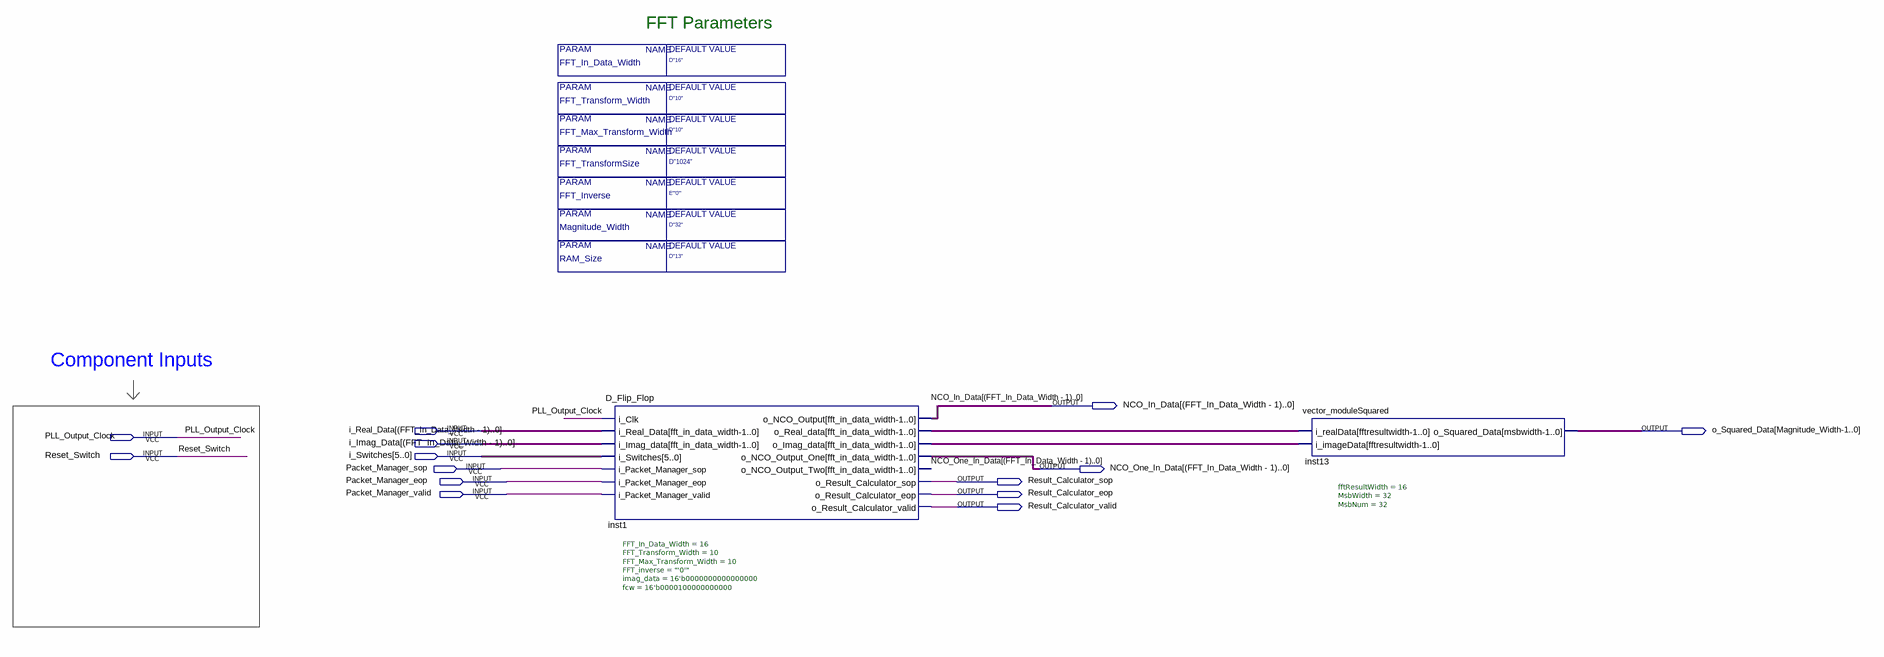
[diagram p0: schematic sheet]
// Quartus schematic FFT_Result_Calculator.bdf as structural Verilog: 2 symbols, 14 pins
module FFT_Result_Calculator #(parameter FFT_Inverse = "E\"'0'\"", parameter FFT_In_Data_Width = "D\"16\"", parameter RAM_Size = "D\"13\"", parameter Magnitude_Width = "D\"32\"", parameter FFT_TransformSize = "D\"1024\"", parameter FFT_Max_Transform_Width = "D\"10\"", parameter FFT_Transform_Width = "D\"10\"") (
  input  \i_Real_Data[(FFT_In_Data_Width_-_1)..0] ,
  input  PLL_Output_Clock,
  input  \i_Imag_Data[(FFT_In_Data_Width_-_1)..0] ,
  input  Reset_Switch,
  input  [5:0] i_Switches,
  input  Packet_Manager_sop,
  input  Packet_Manager_eop,
  input  Packet_Manager_valid,
  output \NCO_In_Data[(FFT_In_Data_Width_-_1)..0] ,
  output \o_Squared_Data[Magnitude_Width-1..0] ,
  output \NCO_One_In_Data[(FFT_In_Data_Width_-_1)..0] ,
  output Result_Calculator_sop,
  output Result_Calculator_eop,
  output Result_Calculator_valid
);

  wire [15:0] inst1_o_imag_data, inst1_o_real_data, undriven, undriven_2;
  wire [31:0] inst13_o_squared_data;

  D_Flip_Flop #(.FFT_In_Data_Width(16), .FFT_Transform_Width(10), .FFT_Max_Transform_Width(10), .FFT_inverse("'0'"), .imag_data(16'b0000000000000000), .fcw(16'b0000100000000000)) inst1 (
    .i_Clk(PLL_Output_Clock), .i_Real_Data(undriven_2), .i_Imag_data(undriven), .i_Switches(i_Switches),
    .i_Packet_Manager_sop(Packet_Manager_sop), .i_Packet_Manager_eop(Packet_Manager_eop),
    .i_Packet_Manager_valid(Packet_Manager_valid), .o_NCO_Output(\NCO_In_Data[(FFT_In_Data_Width_-_1)..0] ),
    .o_Real_data(inst1_o_real_data), .o_Imag_data(inst1_o_imag_data),
    .o_NCO_Output_One(\NCO_One_In_Data[(FFT_In_Data_Width_-_1)..0] ),
    .o_Result_Calculator_sop(Result_Calculator_sop), .o_Result_Calculator_eop(Result_Calculator_eop),
    .o_Result_Calculator_valid(Result_Calculator_valid));  // open: o_NCO_Output_Two
  vector_moduleSquared #(.fftResultWidth(16), .MsbWidth(32), .MsbNum(32)) inst13 (
    .i_realData(inst1_o_real_data), .i_imageData(inst1_o_imag_data), .o_Squared_Data(inst13_o_squared_data));

  // Notes on the sheet:
  //   FFT Parameters
  //   Component Inputs   
endmodule
